# Altium project 简易电表.PrjPcb
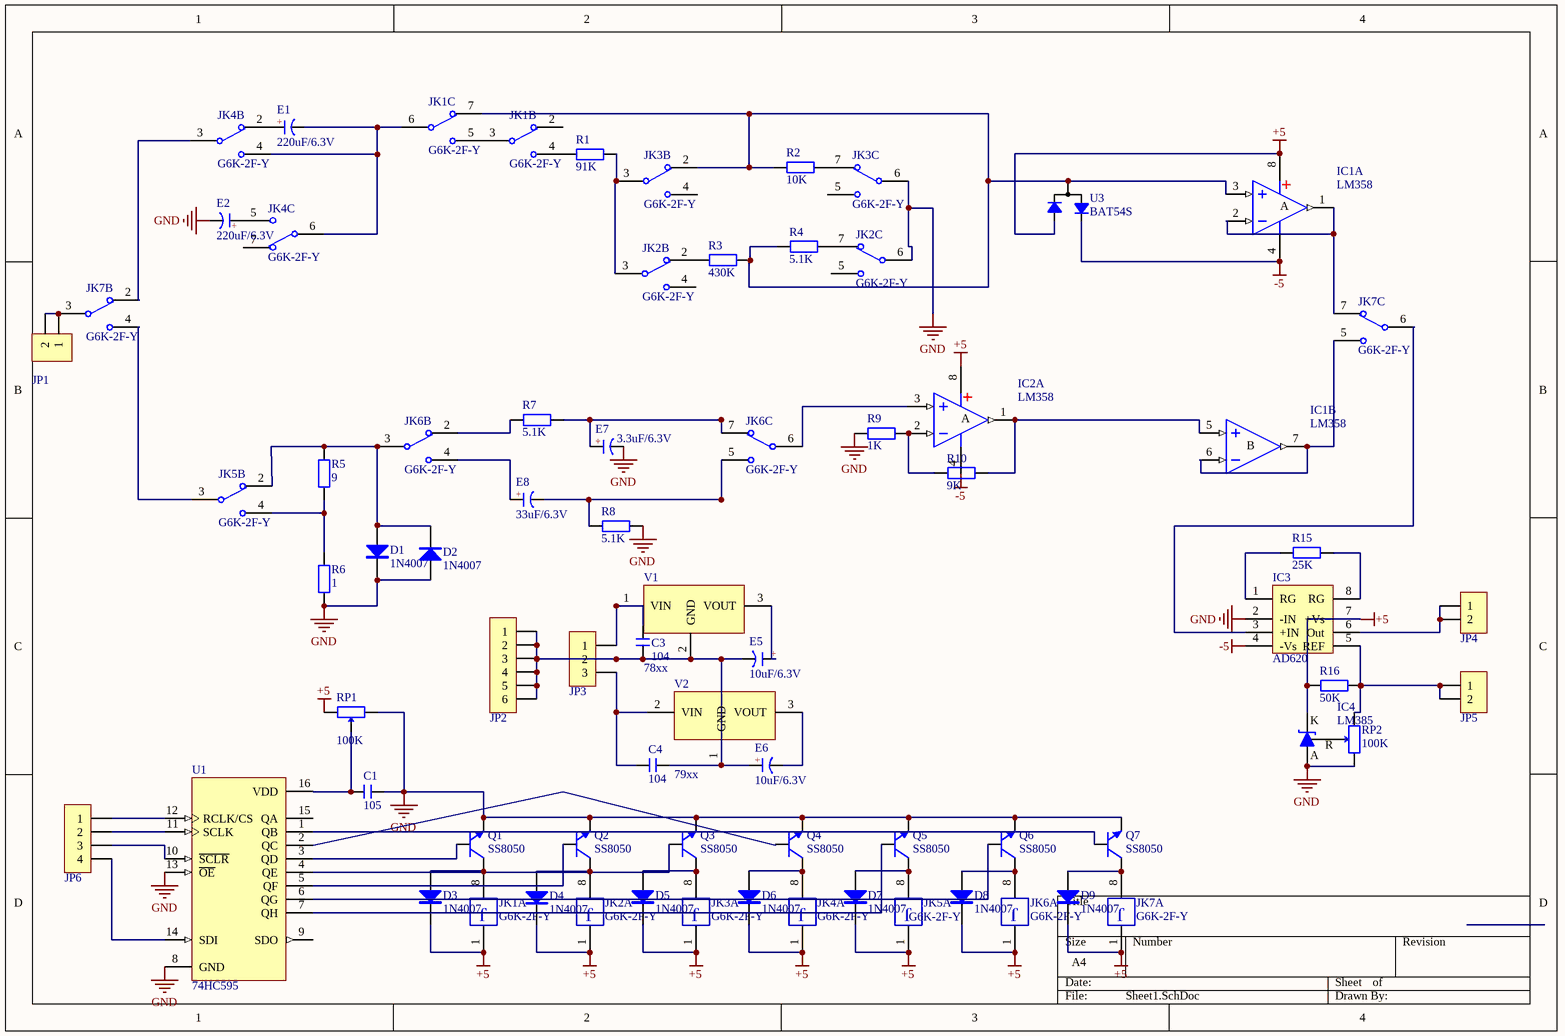
[diagram p0: Sheet1.SchDoc]
1 sheet, 60 parts. Net scope: global (net labels, ports and power ports of the same name join across sheets).
Board files: PCB1.PcbDoc, PCB2.PcbDoc

## Sheet Sheet1.SchDoc
size A4

### Parts
C1  105  [C 0805_L]
C3  104  [C 0805_L]
C4  104  [C 0805_L]
D1  1N4007  [DO-41]
D2  1N4007  [DO-41]
D3  1N4007  [DO-41]
D4  1N4007  [DO-41]
D5  1N4007  [DO-41]
D6  1N4007  [DO-41]
D7  1N4007  [DO-41]
D8  1N4007  [DO-41]
D9  1N4007  [DO-41]
E1  220uF/6.3V  [CS 2.0*5*8 - C]
E2  220uF/6.3V  [CS 2.0*5*8 - C]
E5  10uF/6.3V  [CS 2.0*5*8 - C]
E6  10uF/6.3V  [CS 2.0*5*8 - C]
E7  3.3uF/6.3V  [CS 2.0*5*8 - C]
E8  33uF/6.3V  [CS 2.0*5*8 - C]
IC1  LM358  [SOP8_N]  (parts A,B of 2)
IC2  LM358  [SOP8_N]  (part A of 2)
IC3  AD620  [SOP8_N]
IC4  LM385  [TO92A]
JK1  G6K-2F-Y  [G6K-2F-Y]  (parts A,B,C of 3)
JK2  G6K-2F-Y  [G6K-2F-Y]  (parts A,B,C of 3)
JK3  G6K-2F-Y  [G6K-2F-Y]  (parts A,B,C of 3)
JK4  G6K-2F-Y  [G6K-2F-Y]  (parts A,B,C of 3)
JK5  G6K-2F-Y  [G6K-2F-Y]  (parts A,B of 3)
JK6  G6K-2F-Y  [G6K-2F-Y]  (parts A,B,C of 3)
JK7  G6K-2F-Y  [G6K-2F-Y]  (parts A,B,C of 3)
JP1  HDR-1X2  [HDR2.54-LI-2P]  (value not drawn)
JP2  HDR-1X6  [HDR2.54-LI-6P]  (value not drawn)
JP3  HDR-1X3  [VH3.96-LI-3P]  (value not drawn)
JP4  HDR-1X2  [HDR2.54-LI-2P]  (value not drawn)
JP5  HDR-1X2  [HDR2.54-LI-2P]  (value not drawn)
JP6  HDR-1X4  [HDR2.54-LI-4P]  (value not drawn)
Q1  SS8050  [SOT23-3N]
Q2  SS8050  [SOT23-3N]
Q3  SS8050  [SOT23-3N]
Q4  SS8050  [SOT23-3N]
Q5  SS8050  [SOT23-3N]
Q6  SS8050  [SOT23-3N]
Q7  SS8050  [SOT23-3N]
R1  91K  [R 0805_L]
R2  10K  [R 0805_L]
R3  430K  [R 0805_L]
R4  5.1K  [R 0805_L]
R5  9  [R 0805_L]
R6  1  [R 0805_L]
R7  5.1K  [R 0805_L]
R8  5.1K  [R 0805_L]
R9  1K  [R 0805_L]
R10  9K  [R 0805_L]
R15  25K  [R 0805_L]
R16  50K  [R 0805_L]
RP1  100K  [3296W]
RP2  100K  [3296W]
U1  74HC595  [SOIC-16]
U3  BAT54S  [SOT-23-3]
V1  78xx  [TO220A]
V2  79xx  [TO220A]

### Nets
+5: D3.2(K) D4.2(K) D5.2(K) D6.2(K) D7.2(K) D8.2(K) D9.2(K) IC1.8(V+) IC2.8(V+) JK1.1 JK2.1 JK3.1 JK4.1 JK5.1 JK6.1 JK7.1 RP1.3 U3.1
-5: IC1.4(V-) IC2.4(V-) IC3.4(-Vs) U3.3
GND: C1.2 D1.2(K) D2.1(A) E2.2(K) E7.2(K) IC3.2(-IN) IC4.2(A) JK2.6 JK3.6 Q1.2(E) Q2.2(E) Q3.2(E) Q4.2(E) Q5.2(E) Q6.2(E) Q7.2(E) R6.1 R8.2 R9.1 RP1.1 RP2.3 U1.8(GND) U1.13(~{OE})
NetC1_1: C1.1 RP1.2 U1.16(VDD)
NetC3_1: C3.1 C4.2 E5.2(K) E6.1(A) JP2.1 JP2.2 JP2.3 JP2.4 JP2.5 JP2.6 JP3.2 V1.2(GND) V2.1(GND)
NetC3_2: C3.2 JP3.1 V1.1(VIN)
NetC4_1: C4.1 JP3.3 V2.2(VIN)
NetD1_1: D1.1(A) D2.2(K) JK5.2 JK6.3 R5.1
NetD3_1: D3.1(A) JK1.8 Q1.3(C)
NetD4_1: D4.1(A) JK2.8 Q2.3(C)
NetD5_1: D5.1(A) JK3.8 Q3.3(C)
NetD6_1: D6.1(A) JK4.8 Q4.3(C)
NetD7_1: D7.1(A) JK5.8 Q5.3(C)
NetD8_1: D8.1(A) JK6.8 Q6.3(C)
NetD9_1: D9.1(A) JK7.8 Q7.3(C)
NetE1_1: E1.1(A) JK4.2
NetE1_2: E1.2(K) JK1.6 JK4.4 JK4.6
NetE2_1: E2.1(A) JK4.5
NetE5_1: E5.1(A) V1.3(VOUT)
NetE6_2: E6.2(K) V2.3(VOUT)
NetE7_1: E7.1(A) JK6.7 R7.2
NetE8_1: E8.1(A) JK6.4
NetE8_2: E8.2(K) JK6.5 R8.1
NetIC1_1: IC1.1(OUT) IC1.2(IN-) JK7.7
NetIC1_3: IC1.3(IN+) JK1.7 JK3.2 R2.1 R3.2 R4.1 U3.2
NetIC1_5: IC1.5(IN+) IC2.1(OUT) R10.2
NetIC1_6: IC1.6(IN-) IC1.7(OUT) JK7.5
NetIC2_2: IC2.2(IN-) R9.2 R10.1
NetIC2_3: IC2.3(IN+) JK6.6
NetIC3_1: IC3.1(RG) R15.1
NetIC3_3: IC3.3(+IN) JK7.6
NetIC3_5: IC3.5(REF) JP5.1 JP5.2 R16.2 RP2.1
NetIC3_6: IC3.6(Out) JP4.1 JP4.2
NetIC3_7: IC3.7(+Vs) IC4.3(K) R16.1
NetIC3_8: IC3.8(RG) R15.2
NetIC4_1: IC4.1(R) RP2.2
NetJK1_3: JK1.3 JK1.5
NetJK1_4: JK1.4 R1.1
NetJK2_2: JK2.2 R3.1
NetJK2_3: JK2.3 JK3.3 R1.2
NetJK2_7: JK2.7 R4.2
NetJK3_7: JK3.7 R2.2
NetJK4_3: JK4.3 JK7.2
NetJK5_3: JK5.3 JK7.4
NetJK5_4: JK5.4 R5.2 R6.2
NetJK6_2: JK6.2 R7.1
NetJK7_3: JK7.3 JP1.1 JP1.2
NetJP6_1: JP6.1 U1.12(RCLK/CS)
NetJP6_2: JP6.2 U1.11(SCLK)
NetJP6_3: JP6.3 U1.10(~{SCLR})
NetJP6_4: JP6.4 U1.14(SDI)
NetQ1_1: Q1.1(B) U1.3(QD)
NetQ2_1: Q2.1(B) U1.5(QF)
NetQ3_1: Q3.1(B) U1.4(QE)
NetQ4_1: Q4.1(B) U1.2(QC)
NetQ5_1: Q5.1(B) U1.7(QH)
NetQ6_1: Q6.1(B) U1.6(QG)
NetQ7_1: Q7.1(B) U1.1(QB)

Not connected (* = marked no-connect by the designer): JK1 2; JK2 4 5; JK3 4 5; JK4 7; U1 9(SDO) 15(QA)

### Notes on the sheet
- Labels drawn without touching a wire or pin: +5
- (in symbol C-CS) +
- (in symbol G6K-2F-Y, part A) J
- (in symbol LM358, part A) A
- (in symbol LM358, part B) B

### Library data of the parts
C1 C3 C4 = C: 无极性贴片电容; 版权归属: 源创客; BOM名称: 无极性贴片电容; 学习资源: www.ooocke.com
D1-D9 = 1N4007: 整流二极管; 版权归属: 源创客; BOM名称: 整流二极管; 学习资源: www.ooocke.com
E1 E2 E5-E8 = C-CS: 直插固态电容; 版权归属: 源创客; BOM名称: 直插固态电容; 学习资源: www.ooocke.com
IC1 IC2 = LM358: 双路运放; 版权归属: 源创客; BOM名称: 双路运放; 学习资源: www.ooocke.com
IC3 = AD620: 仪表放大器
IC4 = TL431-ID: 可调基准稳压芯片; 版权归属: 源创客; BOM名称: 可调基准稳压芯片; 学习资源: www.ooocke.com
JK1-JK7 = G6K-2F-Y: 两组转换-信号型; BOM名称: 两组信号继电器; 封装库来自淘宝卖家ID：黄晶宝石: 其他店铺购入均为盗版假冒封装库
JP1 JP4 JP5 = Header 2: 2P接插件; 版权归属: 源创客; BOM名称: 2P接插件; 学习资源: www.ooocke.com
JP2 = Header 6: 6P接插件; 版权归属: 源创客; BOM名称: 6P接插件; 学习资源: www.ooocke.com
JP3 = Header 3: 3P接插件; 版权归属: 源创客; BOM名称: 3P接插件; 学习资源: www.ooocke.com
JP6 = Header 4: 4P接插件; 版权归属: 源创客; BOM名称: 4P接插件; 学习资源: www.ooocke.com
Q1-Q7 = 8050-SMD: 高频放大-NPN型; 版权归属: 源创客; 属性: 40V 1.5A 1W 100MHZ; BOM名称: 高频放大-NPN型; 学习资源: www.ooocke.com
R1-R10 R15 R16 = R: 贴片电阻; 版权归属: 源创客; BOM名称: 贴片电阻; 学习资源: www.ooocke.com
RP1 RP2 = RP-ID: 插件单联电位器; BOM名称: 插件电位器; 版权归属: 源创客; 学习资源: www.ooocke.com
U1 = 74HC595: 移位寄存器; ComponentAvailability: Not for New Design; Published: 15-Apr-2002; LatestRevisionDate: 13-Apr-2006; LatestRevisionNote: IPC-7351 Footprint Added.; DatasheetVersion: 1997; PackageVersion: 1997; PackageReference: 966-01; Publisher: Altium Limited; PackageDescription: 16-Pin Small Outline Package 1.27 mm Pitch; ComponentLink1Description: Manufacturer Link; ComponentLink1URL: http://www.onsemi.com/; ComponentLink2Description: Datasheet; ComponentLink2URL: http://www.onsemi.com/pub/Collateral/MC74VHC595-D.PDF
V1 = 78xx: 线性稳压芯片; 版权归属: 源创客; BOM名称: 线性稳压芯片; 学习资源: www.ooocke.com
V2 = 79xx: 线性稳压芯片; 版权归属: 源创客; BOM名称: 线性稳压芯片; 学习资源: www.ooocke.com